# Altium schematic sheet Sheet1.SchDoc
size A; SheetNumber: 1; SheetTotal: 4
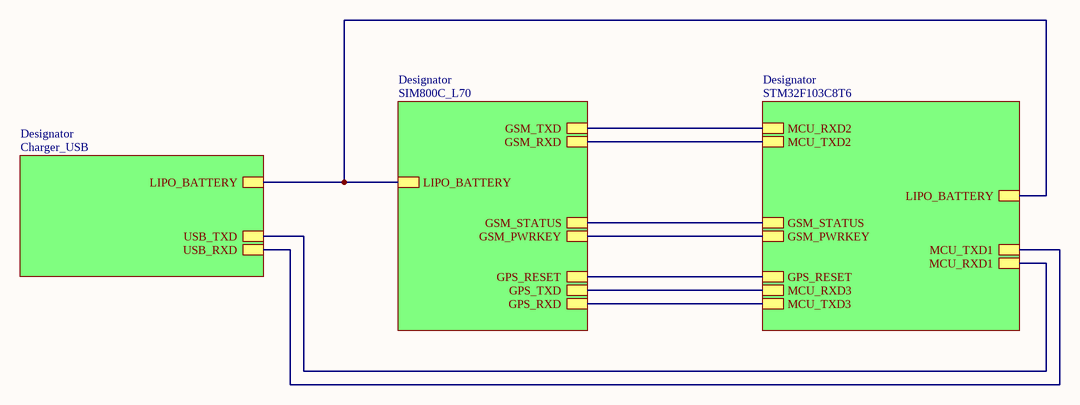
[diagram p0: Sheet1.SchDoc]

## Sub-sheets
Designator = SIM800C_L70: GSM_TXD, GSM_RXD, GSM_STATUS, GSM_PWRKEY, LIPO_BATTERY, GPS_TXD, GPS_RXD, GPS_RESET
Designator = STM32F103C8T6: MCU_RXD2, MCU_TXD2, GSM_STATUS, GSM_PWRKEY, MCU_RXD3, MCU_TXD3, GPS_RESET, LIPO_BATTERY, MCU_TXD1, MCU_RXD1
Designator = Charger_USB: LIPO_BATTERY, USB_TXD, USB_RXD

## Nets
(unnamed): sheet Designator/GSM_TXD, sheet Designator/MCU_RXD2
(unnamed): sheet Designator/GSM_RXD, sheet Designator/MCU_TXD2
(unnamed): sheet Designator/GSM_STATUS, sheet Designator/GSM_STATUS
(unnamed): sheet Designator/GSM_PWRKEY, sheet Designator/GSM_PWRKEY
(unnamed): sheet Designator/LIPO_BATTERY, sheet Designator/LIPO_BATTERY, sheet Designator/LIPO_BATTERY
(unnamed): sheet Designator/GPS_TXD, sheet Designator/MCU_RXD3
(unnamed): sheet Designator/GPS_RXD, sheet Designator/MCU_TXD3
(unnamed): sheet Designator/GPS_RESET, sheet Designator/GPS_RESET
(unnamed): sheet Designator/MCU_TXD1, sheet Designator/USB_RXD
(unnamed): sheet Designator/MCU_RXD1, sheet Designator/USB_TXD